# Altium schematic sheet RS232_and_USB_ports.SchDoc
size A portrait
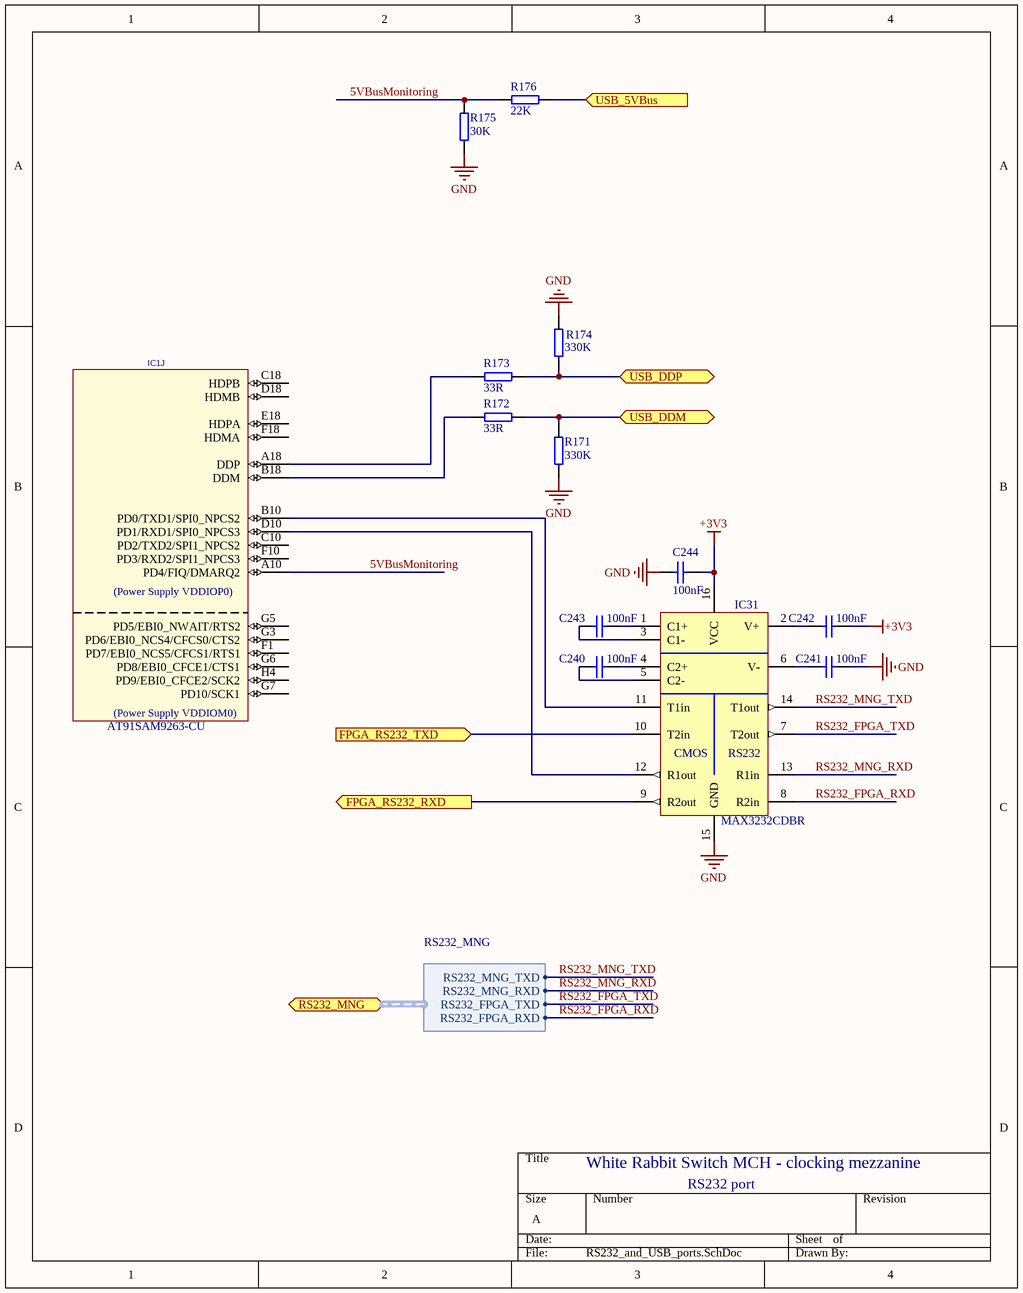
[diagram p0: RS232_and_USB_ports.SchDoc]

## Parts
C240  100nF  [CC1005-0402]
C241  100nF  [CC1005-0402]
C242  100nF  [CC1005-0402]
C243  100nF  [CC1005-0402]
C244  100nF  [CC1005-0402]
IC1  AT91SAM9263-CU  [TFBGA324]  (part J of 12)
IC31  MAX3232CDBR  [SSOP16]
R171  330K  [0402]
R172  33R  [0603]
R173  33R  [0603]
R174  330K  [0402]
R175  30K  [0402]
R176  22K  [0402]

## Ports
FPGA_RS232_RXD (out), FPGA_RS232_TXD (in), RS232_MNG (harness RS232_MNG), USB_5VBus (in), USB_DDM (bidir), USB_DDP (bidir)

## Harnesses
RS232_MNG: RS232_MNG_TXD, RS232_FPGA_TXD, RS232_MNG_RXD, RS232_FPGA_RXD

## Nets
+3V3: C242.1 C244.1 IC31.16(VCC)
GND: C241.1 C244.2 IC31.15(GND) R171.1 R174.2 R175.1
5VBusMonitoring: IC1.A10(PD4/FIQ/DMARQ2) R175.2 R176.2
FPGA_RS232_RXD: IC31.9(R2out) ; port FPGA_RS232_RXD
FPGA_RS232_TXD: IC31.10(T2in) ; port FPGA_RS232_TXD
RS232_FPGA_RXD: IC31.8(R2in) ; port RS232_MNG.RS232_FPGA_RXD
RS232_FPGA_TXD: IC31.7(T2out) ; port RS232_MNG.RS232_FPGA_TXD
RS232_MNG_RXD: IC31.13(R1in) ; port RS232_MNG.RS232_MNG_RXD
RS232_MNG_TXD: IC31.14(T1out) ; port RS232_MNG.RS232_MNG_TXD
USB_5VBus: R176.1 ; port USB_5VBus
USB_DDM: R171.2 R172.2 ; port USB_DDM
USB_DDP: R173.2 R174.1 ; port USB_DDP
NetC240_1: C240.1 IC31.4(C2+)
NetC240_2: C240.2 IC31.5(C2-)
NetC241_2: C241.2 IC31.6(V-)
NetC242_2: C242.2 IC31.2(V+)
NetC243_1: C243.1 IC31.1(C1+)
NetC243_2: C243.2 IC31.3(C1-)
NetIC1_A18: IC1.A18(DDP) R173.1
NetIC1_B10: IC1.B10(PD0/TXD1/SPI0_NPCS2) IC31.11(T1in)
NetIC1_B18: IC1.B18(DDM) R172.1
NetIC1_D10: IC1.D10(PD1/RXD1/SPI0_NPCS3) IC31.12(R1out)

Not connected (* = marked no-connect by the designer): IC1 C10(PD2/TXD2/SPI1_NPCS2) C18(HDPB) D18(HDMB) E18(HDPA) F1(PD7/EBI0_NCS5/CFCS1/RTS1) F10(PD3/RXD2/SPI1_NPCS3) F18(HDMA) G3(PD6/EBI0_NCS4/CFCS0/CTS2) G5(PD5/EBI0_NWAIT/RTS2) G6(PD8/EBI0_CFCE1/CTS1) G7(PD10/SCK1) H4(PD9/EBI0_CFCE2/SCK2)

## Notes on the sheet
- White Rabbit Switch MCH - clocking mezzanine
- RS232 port
- (in symbol AT91SAM9263, part J) (Power Supply VDDIOP0); (Power Supply VDDIOM0)
- (in symbol IFC_MAX3232) CMOS; RS232

## Library data of the parts
C240-C244 = CC0402_100NF_16V_10%_X7R: Capacitor; Manufacturer1: TDK; Manufacturer1 PN: C1005X7R1C104K; TC: X7R; Tolerance: ±10%; Voltage: 16V; Published: 8-Jun-2000; LatestRevisionDate: 17-Jul-2002; LatestRevisionNote: Re-released for DXP Platform.; PackageReference: RAD-0.3; Publisher: Altium Limited; Distributor1: Digikey; Distributor1 PN: 445-4952-1-ND; Case: 0402; Value: 100nF
IC1 = AT91SAM9263: Atmel ARM926 MCU; Supplier: EBV; RefId: AT91SAM9263-CU; Value: AT91SAM9263-CU
IC31 = IFC_MAX3232: RefId: 1575483; Supplier: Farnell; Value: MAX3232CDBR
R171 R174 = R0402_330K_±1%_0.1W_100PPM: SMD Resistor; Manufacturer1: Panasonic; Manufacturer1 PN: ERJ-2RKF3303X; TCR: 100ppm; Power Rating: 0.1W; Tolerance: ±1%; Case: 0402; Distributor1: DigiKey; Distributor1 PN: P330KLCT-ND; Value: 330K
R172 R173 = R0603_33R_±1%_0.25W_100PPM: SMD Resistor; Manufacturer1: Vishay/Dale; Manufacturer1 PN: CRCW060333R0FKEAHP; TCR: 100ppm; Power Rating: 0.25W; Tolerance: ±1%; Case: 0402; Distributor1: DigiKey; Distributor1 PN: 541-33.0SCT-ND; Value: 33R
R175 = R0402_30K_±1%_0.1W_100PPM: SMD Resistor; Manufacturer1: Panasonic; Manufacturer1 PN: ERJ-2RKF3002X; TCR: 100ppm; Power Rating: 0.1W; Tolerance: ±1%; Case: 0402; Distributor1: DigiKey; Distributor1 PN: P30.0KLCT-ND; Value: 30K
R176 = R0402_22K_±1%_0.1W_100PPM: SMD Resistor; Manufacturer1: Panasonic; Manufacturer1 PN: ERJ-2RKF2202X; TCR: 100ppm; Power Rating: 0.1W; Tolerance: ±1%; Case: 0402; Distributor1: DigiKey; Distributor1 PN: P22.0KLCT-ND; Value: 22K